# Altium schematic sheet audio_codec.SchDoc
size A4; SheetNumber: 13; SheetTotal: 21
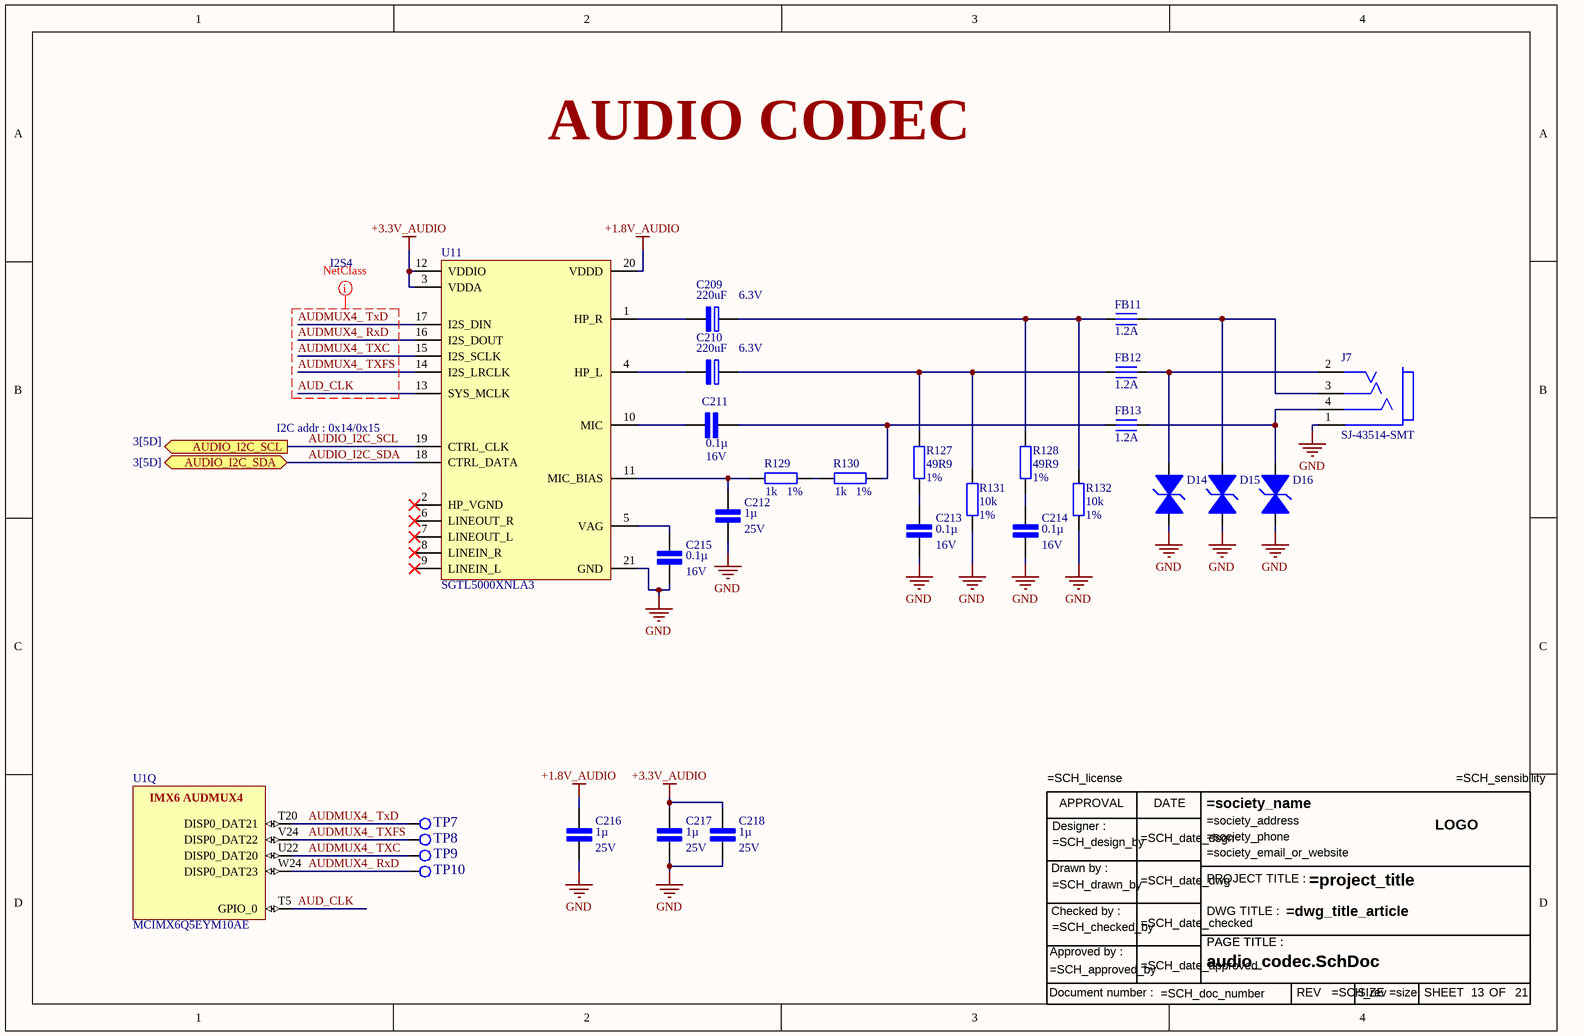
[diagram p0: audio_codec.SchDoc]

## Parts
C209  220uF  Rated Voltage (DC): 6.3V  [cap polymer wurth]
C210  220uF  Rated Voltage (DC): 6.3V  [cap polymer wurth]
C211  0.1µ  Tension du diélectrique: 16V  [Cap cer 0402/1005]
C212  1µ  Tension du diélectrique: 25V  [Cap cer 0402/1005]
C213  0.1µ  Tension du diélectrique: 16V  [Cap cer 0402/1005]
C214  0.1µ  Tension du diélectrique: 16V  [Cap cer 0402/1005]
C215  0.1µ  Tension du diélectrique: 16V  [Cap cer 0402/1005]
C216  1µ  Tension du diélectrique: 25V  [Cap cer 0402/1005]
C217  1µ  Tension du diélectrique: 25V  [Cap cer 0402/1005]
C218  1µ  Tension du diélectrique: 25V  [Cap cer 0402/1005]
D14  TVS 5V  [inductor 0402/1005]  (value not drawn)
D15  TVS 5V  [inductor 0402/1005]  (value not drawn)
D16  TVS 5V  [inductor 0402/1005]  (value not drawn)
FB11  1.2A  [inductor 0402/1005]
FB12  1.2A  [inductor 0402/1005]
FB13  1.2A  [inductor 0402/1005]
J7  SJ-43514-SMT  [Jack SJ-43514-SMT]
R127  49R9  pourcentage: 1%  [Res 0402/1005]
R128  49R9  pourcentage: 1%  [Res 0402/1005]
R129  1k  pourcentage: 1%  [Res 0402/1005]
R130  1k  pourcentage: 1%  [Res 0402/1005]
R131  10k  pourcentage: 1%  [Res 0402/1005]
R132  10k  pourcentage: 1%  [Res 0402/1005]
TB12  Title bloc ANSI modified  (value not drawn)
TP7  Test Point  [testpoint 1mm]  (value not drawn)
TP8  Test Point  [testpoint 1mm]  (value not drawn)
TP9  Test Point  [testpoint 1mm]  (value not drawn)
TP10  Test Point  [testpoint 1mm]  (value not drawn)
U1  MCIMX6Q5EYM10AE  [FRES-2197-01]  (part Q of 21)
U11  SGTL5000XNLA3  [QFN20]

## Ports
AUDIO_I2C_SCL (out, see 3[5D]), AUDIO_I2C_SDA (bidir, see 3[5D])

## Nets
+1.8V_AUDIO: C216.2 U11.20(VDDD)
+3.3V_AUDIO: C217.2 C218.2 U11.3(VDDA) U11.12(VDDIO)
GND: C212.1 C213.2 C214.2 C215.2 C216.1 C217.1 C218.1 D14.2 D15.2 D16.2 J7.1(sleeve) R131.1 R132.1 U11.21(GND)
AUD_CLK: U1.T5(GPIO_0) U11.13(SYS_MCLK)
AUDIO_I2C_SCL: U11.19(CTRL_CLK) ; port AUDIO_I2C_SCL
AUDIO_I2C_SDA: U11.18(CTRL_DATA) ; port AUDIO_I2C_SDA
AUDMUX4_ RxD: TP10.1(tp) U1.W24(DISP0_DAT23) U11.16(I2S_DOUT)
AUDMUX4_ TXC: TP9.1(tp) U1.U22(DISP0_DAT20) U11.15(I2S_SCLK)
AUDMUX4_ TxD: TP7.1(tp) U1.T20(DISP0_DAT21) U11.17(I2S_DIN)
AUDMUX4_ TXFS: TP8.1(tp) U1.V24(DISP0_DAT22) U11.14(I2S_LRCLK)
NetC209_1: C209.1(P) FB11.1 R128.2 R132.2
NetC209_2: C209.2(N) U11.1(HP_R)
NetC210_1: C210.1(P) FB12.1 R127.2 R131.2
NetC210_2: C210.2(N) U11.4(HP_L)
NetC211_1: C211.1 U11.10(MIC)
NetC211_2: C211.2 FB13.1 R130.2
NetC212_2: C212.2 R129.1 U11.11(MIC_BIAS)
NetC213_1: C213.1 R127.1
NetC214_1: C214.1 R128.1
NetC215_1: C215.1 U11.5(VAG)
NetD14_1: D14.1 FB12.2 J7.2(tip)
NetD15_1: D15.1 FB11.2 J7.3(ring_1)
NetD16_1: D16.1 FB13.2 J7.4(ring_2)
NetR129_2: R129.2 R130.1

Not connected (* = marked no-connect by the designer): U11 2(HP_VGND)* 6(LINEOUT_R)* 7(LINEOUT_L)* 8(LINEIN_R)* 9(LINEIN_L)*

## Layout directives
net class I2S4: AUD_CLK, AUDMUX4_ RxD, AUDMUX4_ TXC, AUDMUX4_ TxD, AUDMUX4_ TXFS

## Notes on the sheet
- AUDIO CODEC
- I2C addr : 0x14/0x15
- (in symbol IMX6Q5EYM10AE, part Q) IMX6 AUDMUX4
- (in symbol Title bloc ANSI) APPROVAL; DATE; Designer :; LOGO; Drawn by :; PROJECT TITLE :; Checked by :; DWG TITLE :; PAGE TITLE :; Approved by :; Document number :; REV; SIZE; SHEET; OF

## Library data of the parts
C209 C210 = cap 220µ 6.3V: WCAP-PHGP Aluminum Polymer Capacitor, H-Chip SMT, L7.3W4.3H1.9mm, 220uF, 6.3V 875015119006; Manufacturer: Wurth Elektronik; Capacitance Tolerance: +/-20%; Dissipation Factor: 6%; Endurance: 2000h; ESR: 15mOhm; Leakage Current: 138.6uA; Ripple Current: 5100mA; Technical Reference: PSE2917221M6R3DHCT2HT19; ComponentLink1Description: Manufacturer Link; ComponentLink1URL: https://www.we-online.com/redexpert/article/875015119006?ad; ComponentLink2Description: Datasheet; ComponentLink2URL: https://www.we-online.com/redexpert/spec/875015119006?ad; Category: Aluminum Polymer Capacitors; Match Code: WCAP-PHGP; Manufacturer Part Number: 875015119006; Mount: Surface Mount; Operating Temperature Max: 105°C; Operating Temperature Min: -55°C; Packaging: Tape and Reel; Length: 7.3mm; Width: 4.3mm; Height: 1.9mm; Capacitance: 220uF; Parameter 1: *
C211 C213-C215 = cap 0.1µ 16V: cap solid electrolyte 0.1µ 6.3V 10%; Diélectrique: X7R
C212 C216-C218 = cap 1µ 25V: cap cer 1µ 25V 10% X5R 0402; Diélectrique: X5R
D14-D16 = TVS suppressor 82357120050: 82357120050; ComponentLink1Description: New link; ComponentLink1URL: https://www.we-online.com/catalog/datasheet/82357120050.pdf
FB11-FB13 = Ferrite bead 0402: ferrite bead 1.2A 70mohm / 74269242111; ComponentLink1Description: New link; ComponentLink1URL: https://www.we-online.com/catalog/datasheet/74269242111.pdf
J7 = Audio Jack 3.5mm 4 pin: 4 pole audio Jack SJ-43514-SMT
R127 R128 = res 49R9 1%: res 49R9 ohm 1% 0402
R129 R130 = res 1k 1%: res 1k 1% 0402
R131 R132 = res 10k 1%: res 10k 1% 0402
TB12 = Title bloc ANSI
TP7-TP10 = Test Point: Test point 1mm diameter
U1 = IMX6Q5EYM10AE: 32-Bit i.MX 6 Quad Application Processor, 1 GHz, 256 KB RAM, Extended Consumer Grade, 624-Pin FCPBGA, RoHS, Tape and Reel; PartNumber: MCIMX6Q5EYM10ACR; Manufacturer: Freescale Semiconductor; CAN: FlexCAN; Number of Cores: 4 Spec; External Memory Supported: DDR3, DDR3L, FLASH, LPDDR2; Speed Grade: 1 GHz; Core Type: ARM Cortex A9; Cache (KB): 32; Ethernet: 1 Gbps + IEEE 1588; Internal RAM (KB): 256; ComponentLink1Description: Manufacturer URL; ComponentLink2Description: Datasheet; DatasheetVersion: Rev. 2.3; ComponentLink3URL: http://cache.freescale.com/files/32bit/doc/data_sheet/IMX6DQCEC.pdf?fpsp=1&WT_TYPE=Data%20Sheets&WT_VENDOR=FREESCALE&WT_FILE_FORMAT=pdf&WT_ASSET=Documentation; ComponentLink1URL: http://www.freescale.com/; Packing: Tape and Reel; Temperature Range: -20 to 105 degC; ComponentLink2URL: http://cache.freescale.com/files/32bit/doc/data_sheet/IMX6DQCEC.pdf?fpsp=1&WT_TYPE=Data%20Sheets&WT_VENDOR=FREESCALE&WT_FILE_FORMAT=pdf&WT_ASSET=Documentation; ComponentLink3Description: Package Specification; PackageVersion: Rev. A; RoHS: TRUE; Quad/Dual CPU: i.MX 6Quad; Mounting Technology: Surface Mount; PackageReference: FCPBGA-624; PackageDescription: 624-pin Ball Grid Array Package, Body 21 x 21mm, Pitch 0.8mm
U11 = IC SGTL5000XNLA3: Audio codec